# EAGLE design ESP8266_Transmitter (EAGLE 9.2.0)

## Sheet 1 of 2
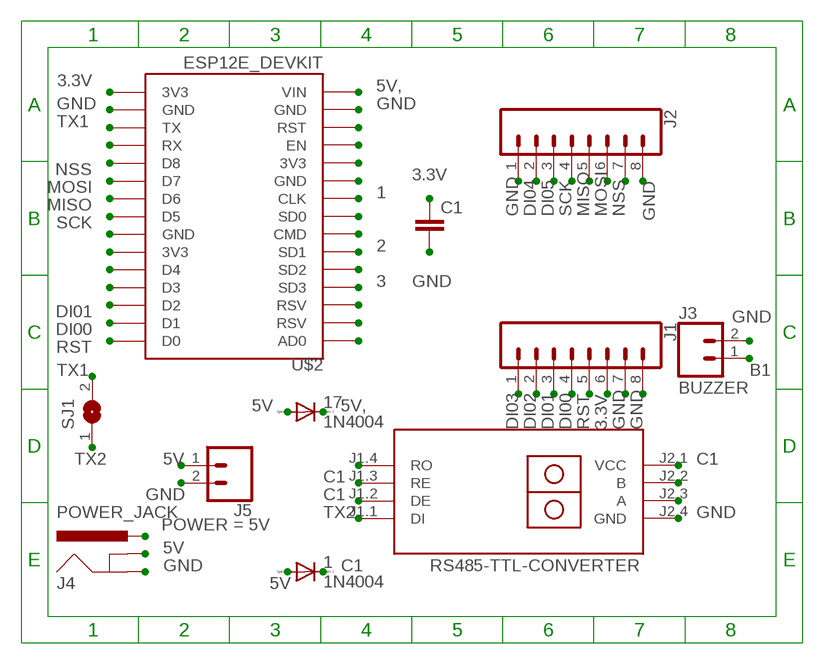
[diagram p0: schematic, sheet 1]

### Parts
1  1N4004  [DO41-10]
17  1N4004  [DO41-10]
C1  C5/3  [C5B3]
J1  CONN_08LONGPADS  [1X08_LONGPADS]
J2  CONN_08LONGPADS  [1X08_LONGPADS]
J3  CONN_025MM  [SCREWTERMINAL-5MM-2]
J4  POWER_JACK  [POWER_JACK_PTH]
J5  CONN_025MM  [SCREWTERMINAL-5MM-2]
RS485-TTL-CONVERTER  RS485-TTL-CONVERTER  [RS485-TTL-CONVERTER]
SJ1  SJ  [SJ]
U$2  ESP12E_DEVKIT  [ESP12E_DEVKIT]

### Nets
1: U$2.CLK
2: U$2.SD1
3: U$2.SD3
3.3V: C1.1 J1.6 U$2.3V3@2(3V3)
5V: 1.A 17.A J4.PWR J5.1
5V,: 17.C U$2.VIN
B1: J3.1
C1: 1.C RS485-TTL-CONVERTER.J1.2(DE) RS485-TTL-CONVERTER.J1.3(RE) RS485-TTL-CONVERTER.J2.1(VCC)
DI00: J1.4 U$2.D1
DI01: J1.3 U$2.D2
DI02: J1.2
DI03: J1.1
DI04: J2.2
DI05: J2.3
GND: C1.2 J1.7 J1.8 J2.1 J2.8 J3.2 J4.GNDBREAK J5.2 RS485-TTL-CONVERTER.J2.4(GND) U$2.GND@1(GND) U$2.GND@3(GND)
MISO: J2.5 U$2.D6
MOSI: J2.6 U$2.D7
N$3: J4.GND
N$6: U$2.RX
N$11: U$2.GND@2(GND)
N$12: U$2.3V3@1(3V3)
N$13: U$2.D4
N$14: U$2.D3
N$19: U$2.AD0
N$20: U$2.RSV@0(RSV)
N$21: U$2.RSV@1(RSV)
N$23: U$2.SD2
N$25: U$2.CMD
N$26: U$2.SD0
N$28: U$2.GND@0(GND)
N$29: U$2.3V3@0(3V3)
N$30: U$2.EN
N$43: RS485-TTL-CONVERTER.J2.2(B)
N$44: RS485-TTL-CONVERTER.J2.3(A)
N$46: U$2.RST
NSS: J2.7 U$2.D8
RS485-TTL-CONVERTER: RS485-TTL-CONVERTER.J1.4(RO)
RST: J1.5 U$2.D0
SCK: J2.4 U$2.D5
TX1: SJ1.2 U$2.TX
TX2: RS485-TTL-CONVERTER.J1.1(DI) SJ1.1

## Sheet 2 of 2

## Library data of the parts
1 17 = diode:1N4004: DIODE general purpose rectifier, 1 A
C1 = capacitor-wima:C: CAPACITOR naming: grid - package width
J1 J2 = SparkFun-Connectors:CONN_08: Multi connection point. Often used as Generic Header-pin footprint for 0.1 inch spaced/style header connections On any of the 0.1 inch spaced packages, you can populate with these: Break Away Headers - Straight <https://www.sparkfun.com/products/116> (PRT-00116) Break Away Male Headers - Right Angle <https://www.sparkfun.com/products/553> (PRT-00553) Female Headers <https://www.sparkfun.com/products/115> (PRT-00115) Break Away Headers - Machine Pin <https://www.sparkfun.com/products/117> (PRT-00117) Break Away Female Headers - Swiss Machine Pin <https://www.sparkfun.com/products/743> (PRT-00743) Arduino Stackable Header - 8 Pin <https://www.sparkfun.com/products/9279> (PRT-09279) For SCREWTERMINALS and SPRING TERMINALS visit here: Screw Terimnals on SparkFun.com <https://www.sparkfun.com/search/results?term=Screw+Terminals> (5mm/3.5mm/2.54mm spacing) This device is also useful as a general connection point to wire up your design to another part of your project. Our various solder wires solder well into these plated through hole pads. Hook-Up Wire - Assortment (Stranded, 22 AWG) <https://www.sparkfun.com/products/11375> (PRT-11375) Hook-Up Wire - Assortment (Solid Core, 22 AWG) <https://www.sparkfun.com/products/11367> (PRT-11367) View the entire wire category on our website here <https://www.sparkfun.com/categories/141> Special notes: Molex polarized connector foot print use with SKU : PRT-08231 with associated crimp pins and housings. 1MM SMD Version SKU: PRT-10208 NOTES ON THE VARIANTS LOCK and LOCK_LONGPADS... This footprint was designed to help hold the alignment of a through-hole component (i.e. 6-pin header) while soldering it into place. You may notice that each hole has been shifted either up or down by 0.005 of an inch from it's more standard position (which is a perfectly straight line). This slight alteration caused the pins (the squares in the middle) to touch the edges of the holes. Because they are alternating, it causes a "brace" to hold the component in place. 0.005 has proven to be the perfect amount of "off-center" position when using our standard breakaway headers. Although looks a little odd when you look at the bare footprint, once you have a header in there, the alteration is very hard to notice. Also,if you push a header all the way into place, it is covered up entirely on the bottom side.
J3 = SparkFun-Retired:CONN_02: Multi connection point. Often used as Generic Header-pin footprint for 0.1 inch spaced/style header connections On any of the 0.1 inch spaced packages, you can populate with these: Break Away Headers - Straight <https://www.sparkfun.com/products/116> (PRT-00116) Break Away Male Headers - Right Angle <https://www.sparkfun.com/products/553> (PRT-00553) Female Headers <https://www.sparkfun.com/products/115> (PRT-00115) Break Away Headers - Machine Pin <https://www.sparkfun.com/products/117> (PRT-00117) Break Away Female Headers - Swiss Machine Pin <https://www.sparkfun.com/products/743> (PRT-00743) For SCREWTERMINALS and SPRING TERMINALS visit here: Screw Terimnals on SparkFun.com <https://www.sparkfun.com/search/results?term=Screw+Terminals> (5mm/3.5mm/2.54mm spacing) This device is also useful as a general connection point to wire up your design to another part of your project. Our various solder wires solder well into these plated through hole pads. Hook-Up Wire - Assortment (Stranded, 22 AWG) <https://www.sparkfun.com/products/11375> (PRT-11375) Hook-Up Wire - Assortment (Solid Core, 22 AWG) <https://www.sparkfun.com/products/11367> (PRT-11367) View the entire wire category on our website here <https://www.sparkfun.com/categories/141> Special notes: Molex polarized connector foot print use with: PRT-08233 with associated crimp pins and housings. 2.54_SCREWTERM for use with PRT-10571. 3.5mm Screw Terminal footprints for PRT-08084 5mm Screw Terminal footprints for use with PRT-08432; SF_SKU: PRT-08432
J4 = SparkFun-Connectors:POWER_JACK: Power Jack Connector This is the standard 5.5mm barrel jack for power. The PTH is the most common, proven, reliable, footprint. The Slot footprint only works if the mill layer is transmitted to the PCB fab house so be warned. Here are the connectors we sell at SparkFun: DC Barrel Power Jack/Connector <https://www.sparkfun.com/products/119> (PRT-00119) DC Barrel Power Jack/Connector (SMD) <https://www.sparkfun.com/products/12748> (PRT-12748) DC Barrel Jack Adapter - Breadboard Compatible <https://www.sparkfun.com/products/10811> (PRT-10811) It is used on this SparkFun product (and many, many others): SparkFun RedBoard - Programmed with Arduino <https://www.sparkfun.com/products/12757> (DEV-12757) Also, if you need a mating power supply or connector, please check these out: Wall Adapter Power Supply - 9VDC 650mA <https://www.sparkfun.com/products/298> (TOL-00298) DC Barrel Jack Adapter - Male <https://www.sparkfun.com/products/10287> (PRT-10287); PROD_ID: CONN-08197
J5 = SparkFun-Retired:CONN_02: Multi connection point. Often used as Generic Header-pin footprint for 0.1 inch spaced/style header connections On any of the 0.1 inch spaced packages, you can populate with these: Break Away Headers - Straight <https://www.sparkfun.com/products/116> (PRT-00116) Break Away Male Headers - Right Angle <https://www.sparkfun.com/products/553> (PRT-00553) Female Headers <https://www.sparkfun.com/products/115> (PRT-00115) Break Away Headers - Machine Pin <https://www.sparkfun.com/products/117> (PRT-00117) Break Away Female Headers - Swiss Machine Pin <https://www.sparkfun.com/products/743> (PRT-00743) For SCREWTERMINALS and SPRING TERMINALS visit here: Screw Terimnals on SparkFun.com <https://www.sparkfun.com/search/results?term=Screw+Terminals> (5mm/3.5mm/2.54mm spacing) This device is also useful as a general connection point to wire up your design to another part of your project. Our various solder wires solder well into these plated through hole pads. Hook-Up Wire - Assortment (Stranded, 22 AWG) <https://www.sparkfun.com/products/11375> (PRT-11375) Hook-Up Wire - Assortment (Solid Core, 22 AWG) <https://www.sparkfun.com/products/11367> (PRT-11367) View the entire wire category on our website here <https://www.sparkfun.com/categories/141> Special notes: Molex polarized connector foot print use with: PRT-08233 with associated crimp pins and housings. 2.54_SCREWTERM for use with PRT-10571. 3.5mm Screw Terminal footprints for PRT-08084 5mm Screw Terminal footprints for use with PRT-08432; POWER: 5V; SF_SKU: PRT-08432
RS485-TTL-CONVERTER = diy-modules:RS485-TTL-CONVERTER: RS485 to TTL converter based on MAX485 chip
SJ1 = jumper:SJ: SMD solder JUMPER
U$2 = ESP8266:ESP12E_DEVKIT: ESP12E DEVKIT BOARD

## Board
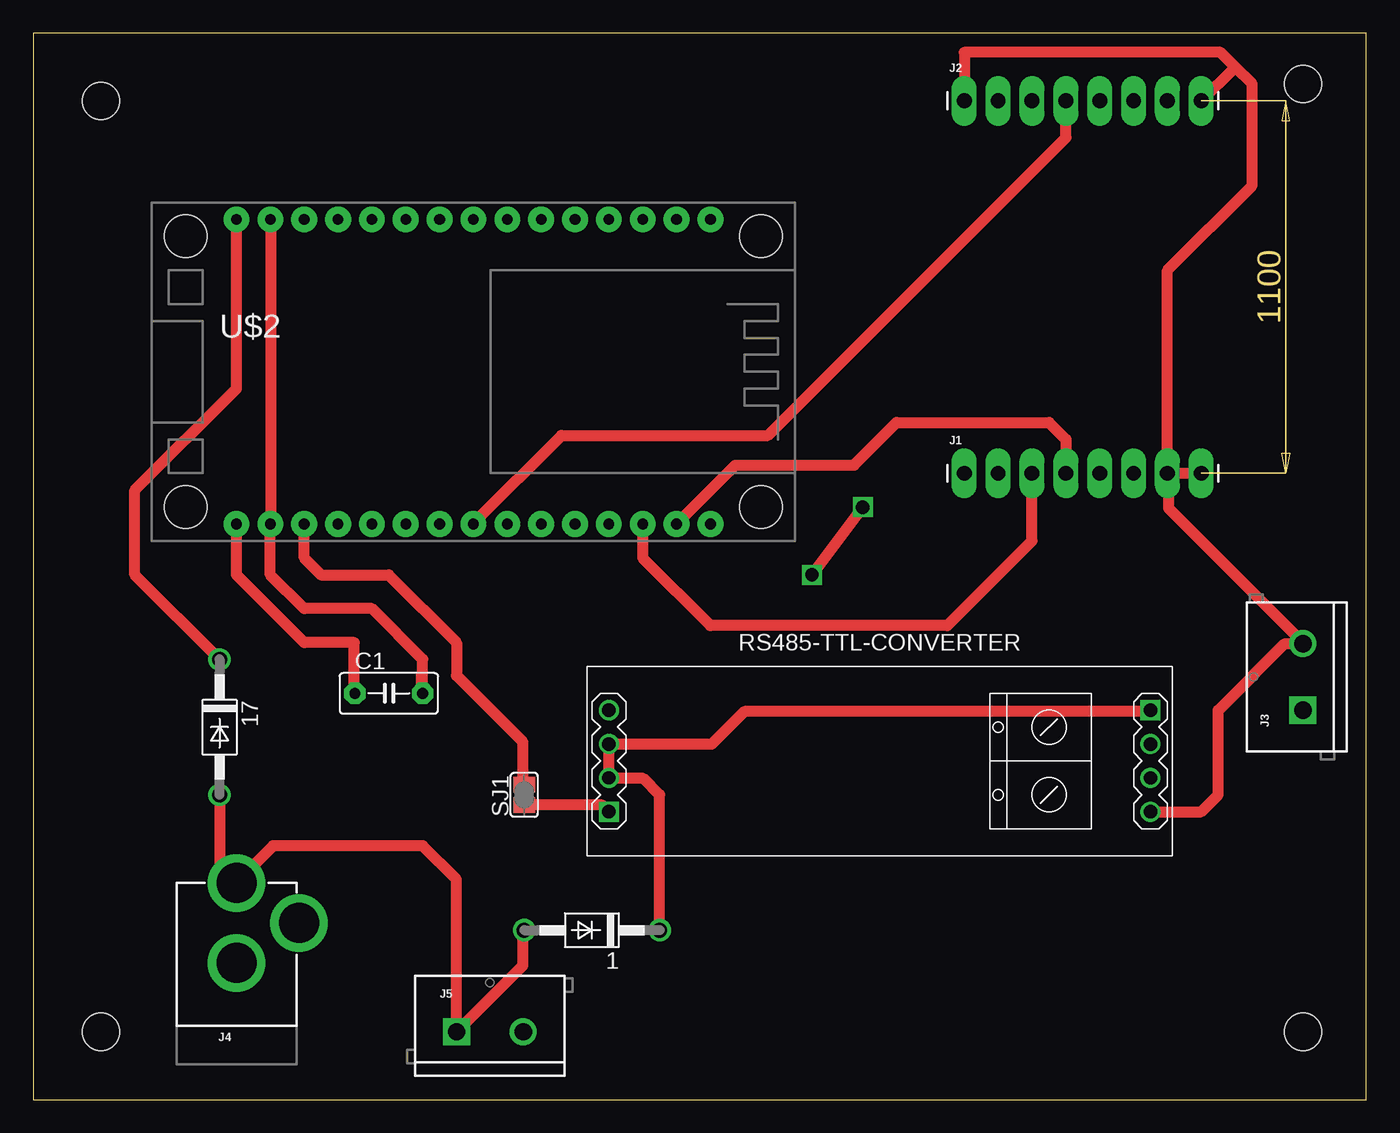
[diagram p1: board, top side]
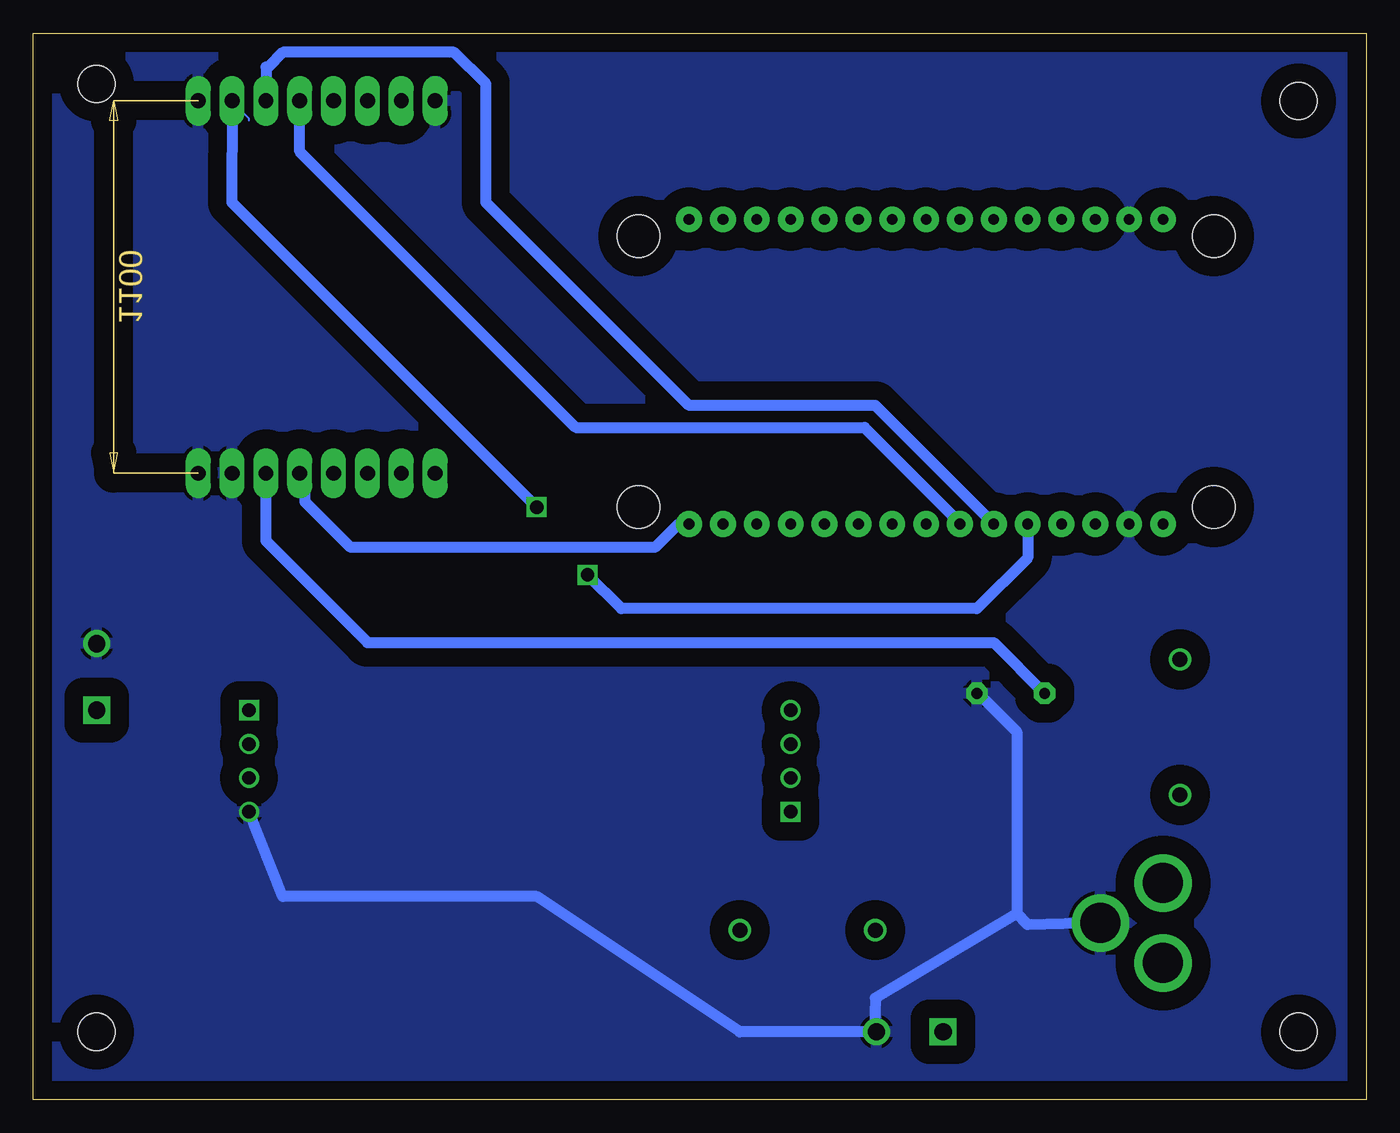
[diagram p2: board, bottom side, seen from below]

Size 100 x 80 mm. Coordinates in mm from the lower left corner, seen from the top.
Outline: 0,0 100,0 100,80 0,80 0,0
Copper layers (1*16): Top 0.035mm / dielectric 1.5mm / Bottom 0.035mm
Design rules "default": minimum track width 6mil, minimum drill 0.35mm, track to track 6mil, track to pad 6mil, pad to pad 6mil, via to via 6mil, smd to smd 6mil, copper to edge 40mil, drill to drill 6mil, minimum pad ring 10mil, minimum via ring 8mil, stop-mask expansion 4mil, vias tented up to drill 0mil, thermal gap 10mil
Holes 2.79 mm at 5.08,74.93 95.25,76.2 95.25,5.08 5.08,5.08

### Footprints (pad centres in the part's own frame; a part is rotated, then mirrored left to right if it is on the bottom)
DO41-10 = drill 1.118: A 5.08,0; C -5.08,0
C5B3 = drill 0.813 pad 1.6 octagon: 1 -2.54,0; 2 2.54,0
1X08_LONGPADS = drill 1.118 pad 1.88 long: 1 0,0; 2 2.54,0; 3 5.08,0; 4 7.62,0; 5 10.16,0; 6 12.7,0; 7 15.24,0; 8 17.78,0
SCREWTERMINAL-5MM-2 = drill 1.3 pad 2.032 square: 1 0,0 | drill 1.3 pad 2.032: 2 5,0
POWER_JACK_PTH = drill 2.997 pad 4.318: GND 0,7.7; GNDBREAK 4.7,10.7; PWR 0,13.7
RS485-TTL-CONVERTER = drill 1 square: J1.1 -20.32,-3.81; J2.1 20.32,3.81 | drill 1: J1.2 -20.32,-1.27; J1.3 -20.32,1.27; J1.4 -20.32,3.81; J2.2 20.32,1.27; J2.3 20.32,-1.27; J2.4 20.32,-3.81
SJ = smd 1.168 x 1.6: 1 -0.762,0; 2 0.762,0
ESP12E_DEVKIT = drill 0.8 pad 1.93: 3V3@0 -11.43,-7.62; 3V3@1 11.43,5.08; 3V3@2 11.43,-17.78; AD0 -11.43,17.78; CLK -11.43,-2.54; CMD -11.43,2.54; D0 11.43,17.78; D1 11.43,15.24; D2 11.43,12.7; D3 11.43,10.16; D4 11.43,7.62; D5 11.43,0; D6 11.43,-2.54; D7 11.43,-5.08; D8 11.43,-7.62; EN -11.43,-10.16; GND@0 -11.43,-5.08; GND@1 -11.43,-15.24; GND@2 11.43,2.54; GND@3 11.43,-15.24; RST -11.43,-12.7; RSV@0 -11.43,15.24; RSV@1 -11.43,12.7; RX 11.43,-10.16; SD0 -11.43,0; SD1 -11.43,5.08; SD2 -11.43,7.62; SD3 -11.43,10.16; TX 11.43,-12.7; VIN -11.43,-17.78 | hole 3.2: -10.16,21.59; 10.16,21.59; 10.16,-21.59; -10.16,-21.59

### Placement (x,y rotation side)
1  41.91,12.7 180 top
17  13.97,27.94 270 top
C1  26.67,30.48 0 top
J1  69.85,46.99 0 top
J2  69.85,74.93 0 top
J3  95.25,29.21 90 top
J4  15.24,2.54 0 top
J5  31.75,5.08 0 top
RS485-TTL-CONVERTER  63.5,25.4 0 top
SJ1  36.83,22.86 90 top
U$2  33.02,54.61 270 top

### Tracks (layer width: path | path; a pad name or v marks a point on that pad's centre or on a via)
3.3V
  Top 0.152: 24.08,30.48 C1.1 | 15.24,43.13 U$2.3V3@2
  Top 0.813: 24.08,30.48 24.08,34.29 20.32,34.29 15.24,39.37 U$2.3V3@2
  Bottom 0.813: J1.6 82.55,41.91 74.93,34.29 27.94,34.29 C1.1
5V
  Top 0.152: 36.73,12.65 1.A | 14.02,17.53 15.24,16.31 J4.PWR 15.24,16.15 | 14.02,22.86 17.A
  Top 0.813: 36.73,12.65 36.73,10.06 J5.1 | 14.02,22.86 14.02,17.53 14.02,17.46 J4.PWR | J5.1 31.75,6.1 | J5.1 31.75,16.51 29.21,19.05 17.98,19.05 15.24,16.31
5V,
  Top 0.813: 17.C 7.62,39.37 7.62,45.72 15.24,53.34 U$2.VIN
C1
  Top 0.152: RS485-TTL-CONVERTER.J1.3 43.28,26.67 43.28,24.23 RS485-TTL-CONVERTER.J1.2 43.28,24.08
  Top 0.813: 1.C 46.99,22.86 45.77,24.08 43.28,24.08 | RS485-TTL-CONVERTER.J1.2 RS485-TTL-CONVERTER.J1.3 50.9,26.67 53.34,29.11 83.72,29.11 RS485-TTL-CONVERTER.J2.1
DI00
  Top 0.152: 77.42,47.09 J1.4
  Top 0.813: U$2.D1 52.68,47.6 61.57,47.6 64.77,50.8 76.2,50.8 77.47,49.53 77.47,47.14 77.42,47.09
DI01
  Top 0.813: U$2.D2 45.72,40.64 50.8,35.56 68.58,35.56 74.93,41.91 J1.3
GND
  Top 0.152: 95.25,34.14 J3.2 95.25,34.29 | 85.19,46.94 J1.7 | 29.11,30.48 C1.2 | 17.83,65.99 U$2.GND@1 | 17.83,43.28 U$2.GND@3
  Top 0.813: 85.19,46.94 85.19,44.35 95.25,34.29 | 29.11,31.85 29.11,30.48 | 17.83,43.28 17.83,65.99 | RS485-TTL-CONVERTER.J2.4 87.63,21.59 88.9,22.86 88.9,29.21 93.9,34.21 J3.2 | C1.2 29.21,33.02 25.4,36.83 20.32,36.83 17.78,39.37 U$2.GND@3 | 90.17,77.47 91.44,76.2 91.44,68.58 85.09,62.23 J1.7 J1.8 | 90.17,77.47 89.06,78.58 69.85,78.58 J2.1 | J2.8 90.17,77.47
  Bottom 0.152: 36.73,5.18 J5.2 36.88,5.18 | C1.2 29.11,30.48 | 83.82,21.49 RS485-TTL-CONVERTER.J2.4
  Bottom 0.813: J4.GNDBREAK 25.4,13.11 26.21,13.97 | 26.21,13.97 26.21,27.58 29.11,30.48 | 26.21,13.97 36.83,7.62 36.88,5.18 | J5.2 46.99,5.08 62.23,15.24 81.28,15.24 RS485-TTL-CONVERTER.J2.4
  pour Bottom (isolate 1.397): 0,80.01 100.33,80.01 100.33,0 0,0
MISO
  Bottom 0.813: U$2.D6 31.06,43.76 31.06,43.85 37.63,50.42 59.31,50.42 80.01,71.12 J2.5
MOSI
  Bottom 0.813: U$2.D7 36.83,52.07 50.8,52.07 66.04,67.31 66.04,76.2 68.42,78.58 81.28,78.58 82.39,77.47 82.55,77.47 J2.6
NSS  (via drill 1)
  Top 0.813: v58.42,39.37 v62.23,44.45
  Bottom 0.152: 83.82,73.46 83.82,73.61 85.04,74.83 J2.7
  Bottom 0.813: U$2.D8 25.4,40.64 29.21,36.83 55.88,36.83 v58.42,39.37 | v62.23,44.45 85.09,67.31 85.04,74.83
RST
  Bottom 0.152: 80.01,46.94 J1.5
  Bottom 0.813: U$2.D0 51.61,43.18 53.36,41.43 76.19,41.43 79.61,44.85 79.61,46.54 80.01,46.94
SCK
  Top 0.152: 33.07,43.28 U$2.D5
  Top 0.813: 33.07,43.28 39.62,49.84 55.12,49.84 77.47,72.19 J2.4
TX1
  Top 0.152: 36.73,23.62 SJ1.2 | 20.42,43.13 U$2.TX
  Top 0.813: 36.73,23.62 36.73,26.82 31.75,31.8 31.75,34.29 26.67,39.37 21.59,39.37 20.32,40.64 U$2.TX
TX2
  Top 0.152: RS485-TTL-CONVERTER.J1.1 42.67,22.1
  Top 0.813: 42.67,22.1 SJ1.1